# Altium project led-controller2.PrjPcb
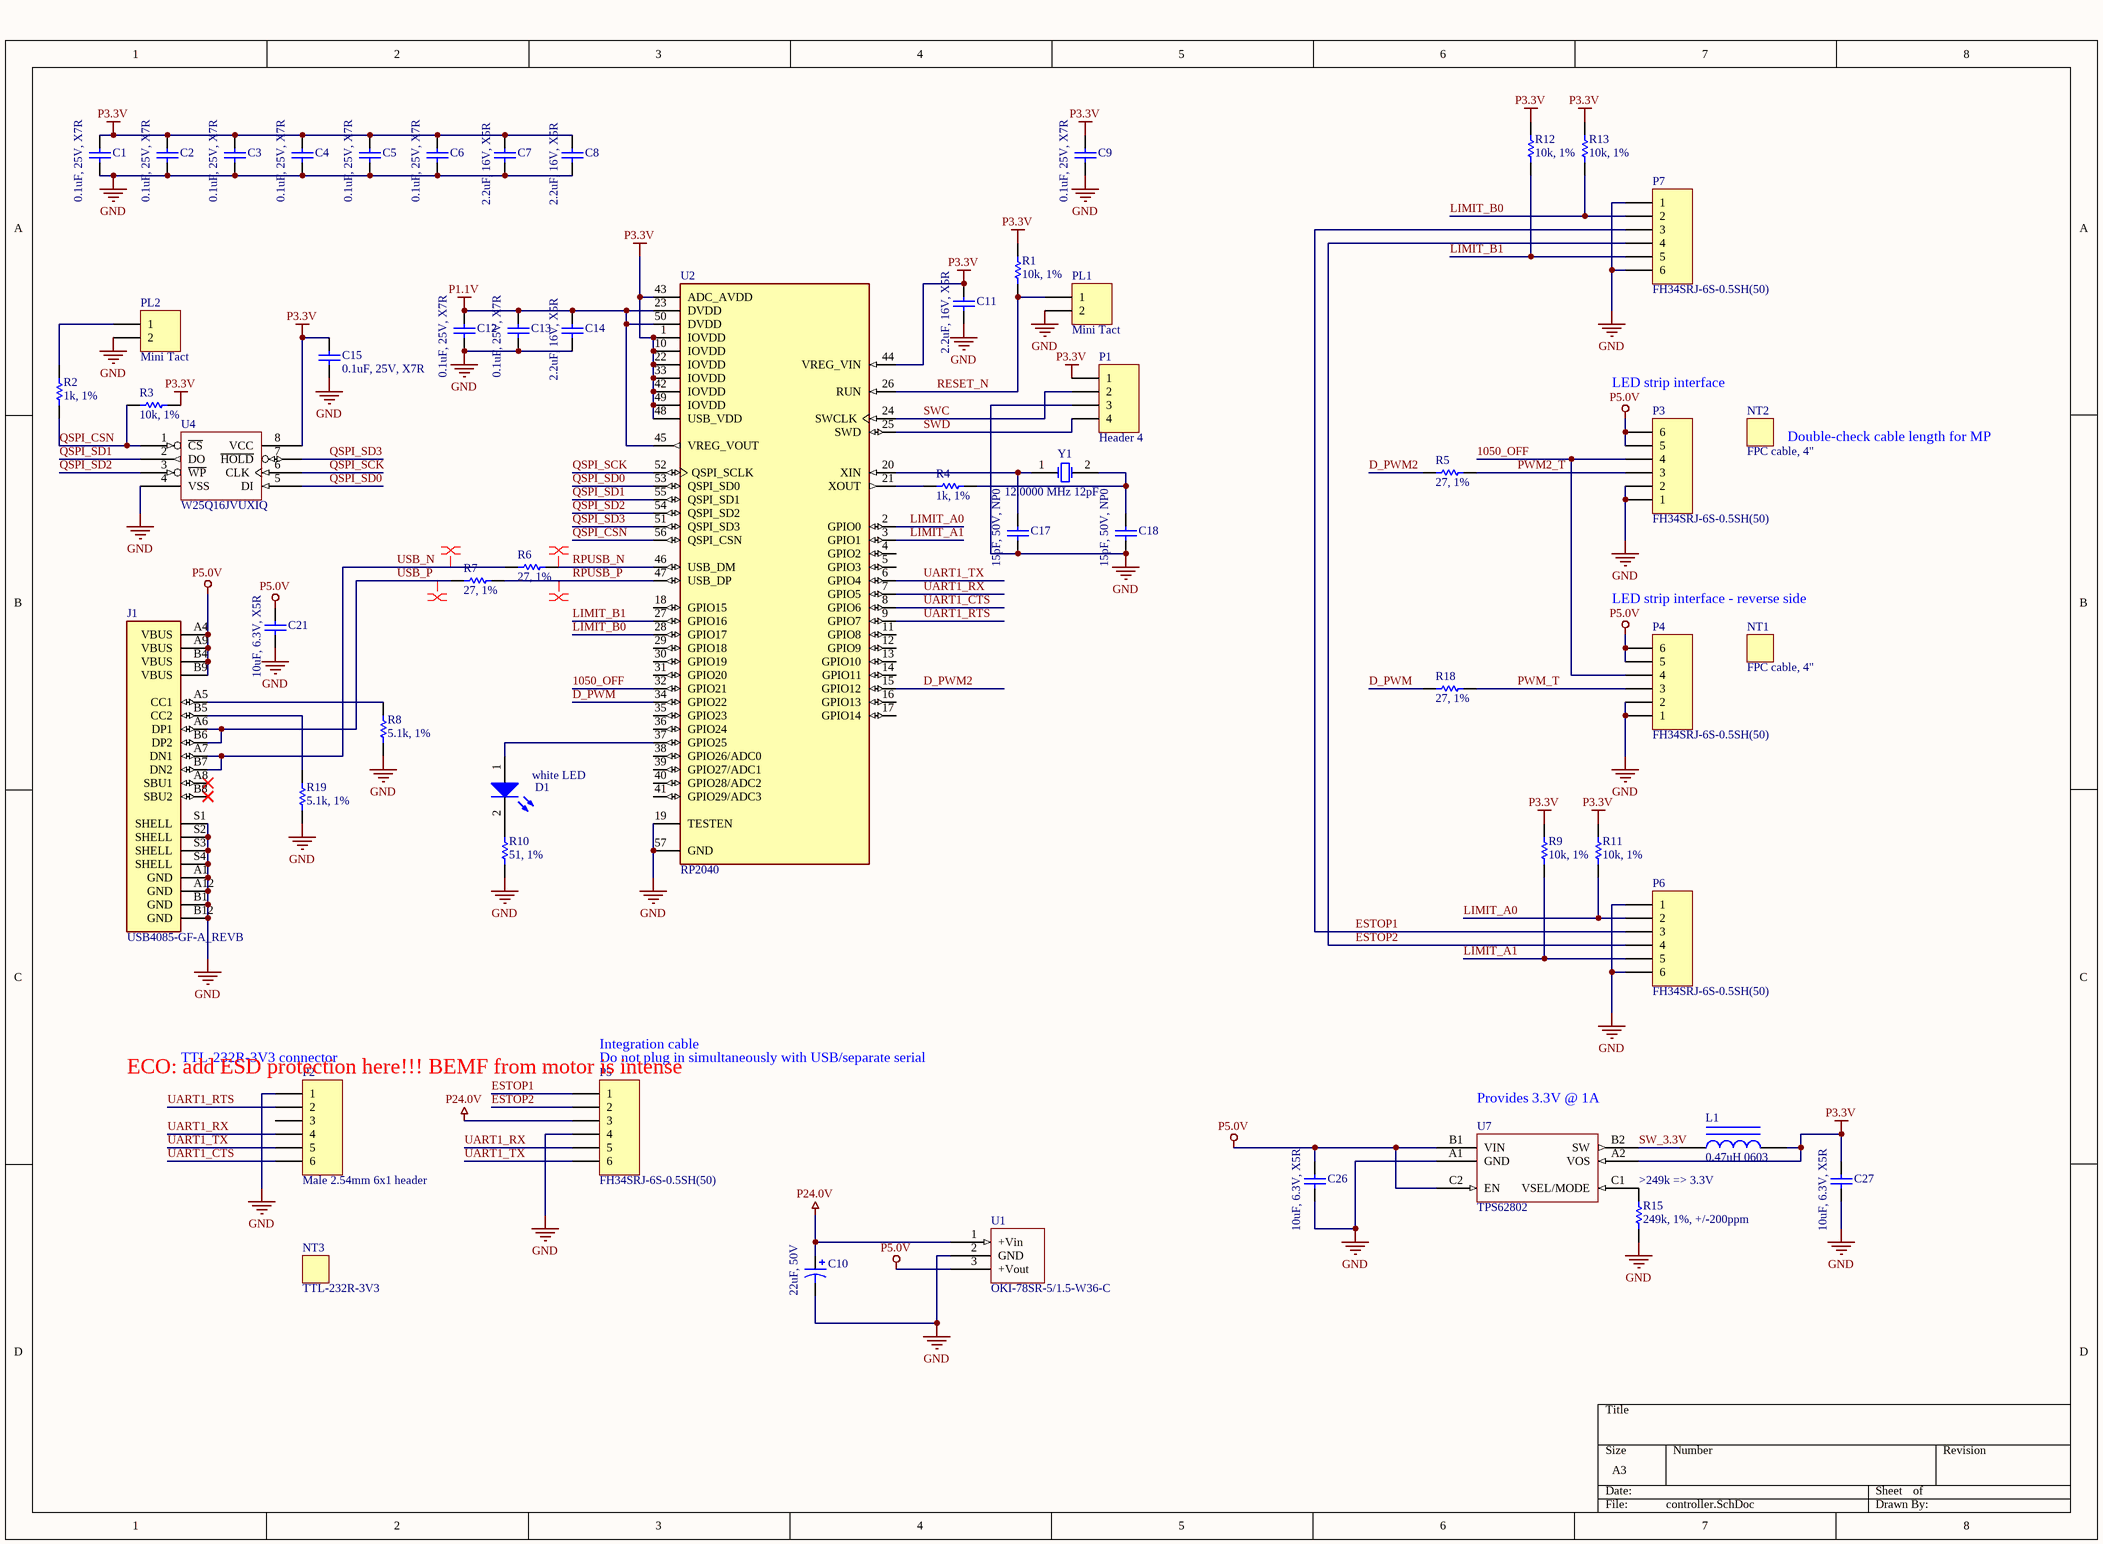
[diagram p0: controller.SchDoc]
1 sheet, 56 parts. Net scope: global (net labels, ports and power ports of the same name join across sheets).
Board file: led-controller2.PcbDoc

## Sheet controller.SchDoc
size A3; SheetNumber: 1; SheetTotal: 1

### Parts
C1  0.1uF, 25V, X7R  [B_CAP0603]
C2  0.1uF, 25V, X7R  [B_CAP0603]
C3  0.1uF, 25V, X7R  [B_CAP0603]
C4  0.1uF, 25V, X7R  [B_CAP0603]
C5  0.1uF, 25V, X7R  [B_CAP0603]
C6  0.1uF, 25V, X7R  [B_CAP0603]
C7  2.2uF, 16V, X5R  [B_CAP0603]
C8  2.2uF, 16V, X5R  [B_CAP0603]
C9  0.1uF, 25V, X7R  [B_CAP0603]
C10  22uF, 50V  [CAPAE7066X61N]
C11  2.2uF, 16V, X5R  [B_CAP0603]
C12  0.1uF, 25V, X7R  [B_CAP0603]
C13  0.1uF, 25V, X7R  [B_CAP0603]
C14  2.2uF, 16V, X5R  [B_CAP0603]
C15  0.1uF, 25V, X7R  [B_CAP0603]
C17  15pF, 50V, NP0  [B_CAP0603]
C18  15pF, 50V, NP0  [B_CAP0603]
C21  10uF, 6.3V, X5R  [B_CAP0603]
C26  10uF, 6.3V, X5R  [B_CAP0603]
C27  10uF, 6.3V, X5R  [B_CAP0603]
D1  white LED  [B_LED0805]
J1  USB4085-GF-A_REVB  [GCT_USB4085-GF-A_REVB]
L1  0.47uH 0603  [B_IND0603]
NT1  FPC cable, 4"
NT2  FPC cable, 4"
NT3  TTL-232R-3V3
P1  Header 4  [HDR1X4]
P2  Male 2.54mm 6x1 header  [HDR1X6]
P3  FH34SRJ-6S-0.5SH(50)  [HRS_FH34SRJ-6S-0.5SH(50)]
P4  FH34SRJ-6S-0.5SH(50)  [HRS_FH34SRJ-6S-0.5SH(50)]
P5  FH34SRJ-6S-0.5SH(50)  [HRS_FH34SRJ-6S-0.5SH(50)]
P6  FH34SRJ-6S-0.5SH(50)  [HRS_FH34SRJ-6S-0.5SH(50)]
P7  FH34SRJ-6S-0.5SH(50)  [HRS_FH34SRJ-6S-0.5SH(50)]
PL1  Mini Tact  [OMRON_B3U-1000P]
PL2  Mini Tact  [OMRON_B3U-1000P]
R1  10k, 1%  [B_RES0603]
R2  1k, 1%  [B_RES0603]
R3  10k, 1%  [B_RES0603]
R4  1k, 1%  [B_RES0603]
R5  27, 1%  [B_RES0603]
R6  27, 1%  [B_RES0603]
R7  27, 1%  [B_RES0603]
R8  5.1k, 1%  [B_RES0603]
R9  10k, 1%  [B_RES0603]
R10  51, 1%  [B_RES0603]
R11  10k, 1%  [B_RES0603]
R12  10k, 1%  [B_RES0603]
R13  10k, 1%  [B_RES0603]
R15  249k, 1%, +/-200ppm  [B_RES0402]
R18  27, 1%  [B_RES0603]
R19  5.1k, 1%  [B_RES0603]
U1  OKI-78SR-5/1.5-W36-C  [MURATA_OKI-78SR]
U2  RP2040  [QFN40P700X700X90-57N]
U4  W25Q16JVUXIQ  [USON-8]
U7  TPS62802  [BGA6C35P2X3_70X105X40_NSMD]
Y1  12.0000 MHz 12pF  [NDK_NX5032A]

### Nets
GND: C1.2 C2.2 C3.2 C4.2 C5.2 C6.2 C7.2 C8.2 C9.2 C10.2 C11.2 C12.2 C13.2 C14.2 C15.1 C17.1 C18.1 C21.2 C26.2 C27.2 J1.A1(GND) J1.A12(GND) J1.B1(GND) J1.B12(GND) J1.S1(SHELL) J1.S2(SHELL) J1.S3(SHELL) J1.S4(SHELL) P1.3 P2.1 P3.1 P3.2 P4.1 P4.2 P5.4 P6.1 P6.6 P7.1 P7.6 PL1.2 PL2.2 R8.1 R10.1 R15.2 R19.1 U1.2(GND) U2.19(TESTEN) U2.57(GND) U4.4(VSS) U7.A1(GND)
P1.1V: C12.1 C13.1 C14.1 U2.23(DVDD) U2.45(VREG_VOUT) U2.50(DVDD)
P3.3V: C1.1 C2.1 C3.1 C4.1 C5.1 C6.1 C7.1 C8.1 C9.1 C11.1 C15.2 C27.1 L1.2 P1.1 R1.1 R3.2 R9.1 R11.1 R12.1 R13.1 U2.1(IOVDD) U2.10(IOVDD) U2.22(IOVDD) U2.33(IOVDD) U2.42(IOVDD) U2.43(ADC_AVDD) U2.44(VREG_VIN) U2.48(USB_VDD) U2.49(IOVDD) U4.8(VCC) U7.A2(VOS)
P5.0V: C21.1 C26.1 J1.A4(VBUS) J1.A9(VBUS) J1.B4(VBUS) J1.B9(VBUS) P3.5 P3.6 P4.5 P4.6 U1.3(+Vout) U7.B1(VIN) U7.C2(EN)
P24.0V: C10.1 P5.3 U1.1(+Vin)
1050_OFF: P3.4 P4.4 U2.32(GPIO21)
D_PWM: R18.1 U2.34(GPIO22)
D_PWM2: R5.1 U2.15(GPIO12)
ESTOP1: P5.1 P6.3 P7.3
ESTOP2: P5.2 P6.4 P7.4
LIMIT_A0: P6.2 R11.2 U2.2(GPIO0)
LIMIT_A1: P6.5 R9.2 U2.3(GPIO1)
LIMIT_B0: P7.2 R13.2 U2.28(GPIO17)
LIMIT_B1: P7.5 R12.2 U2.27(GPIO16)
PWM2_T: P3.3 R5.2
PWM_T: P4.3 R18.2
QSPI_CSN: R2.1 R3.1 U2.56(QSPI_CSN) U4.1(~{CS})
QSPI_SCK: U2.52(QSPI_SCLK) U4.6(CLK)
QSPI_SD0: U2.53(QSPI_SD0) U4.5(DI)
QSPI_SD1: U2.55(QSPI_SD1) U4.2(DO)
QSPI_SD2: U2.54(QSPI_SD2) U4.3(~{WP})
QSPI_SD3: U2.51(QSPI_SD3) U4.7(~{HOLD})
RESET_N: PL1.1 R1.2 U2.26(RUN)
RPUSB_N: R6.2 U2.46(USB_DM)
RPUSB_P: R7.2 U2.47(USB_DP)
SW_3.3V: L1.1 U7.B2(SW)
SWC: P1.2 U2.24(SWCLK)
SWD: P1.4 U2.25(SWD)
UART1_CTS: P2.6 U2.8(GPIO6)
UART1_RTS: P2.2 U2.9(GPIO7)
UART1_RX: P2.4 P5.5 U2.7(GPIO5)
UART1_TX: P2.5 P5.6 U2.6(GPIO4)
USB_N: J1.A7(DN1) J1.B7(DN2) R6.1
USB_P: J1.A6(DP1) J1.B6(DP2) R7.1
NetC17_2: C17.2 U2.20(XIN) Y1.1(OSC1)
NetC18_2: C18.2 R4.2 Y1.2(OSC2)
NetD1_1: D1.1(A) U2.37(GPIO25)
NetD1_2: D1.2(K) R10.2
NetJ1_A5: J1.A5(CC1) R8.2
NetJ1_B5: J1.B5(CC2) R19.2
NetPL2_1: PL2.1 R2.2
NetR4_1: R4.1 U2.21(XOUT)
NetR15_1: R15.1 U7.C1(VSEL/MODE)

Not connected (* = marked no-connect by the designer): J1 A8(SBU1)* B8(SBU2)*; P2 3; U2 4(GPIO2) 5(GPIO3) 11(GPIO8) 12(GPIO9) 13(GPIO10) 14(GPIO11) 16(GPIO13) 17(GPIO14) 18(GPIO15) 29(GPIO18) 30(GPIO19) 31(GPIO20) 35(GPIO23) 36(GPIO24) 38(GPIO26/ADC0) 39(GPIO27/ADC1) 40(GPIO28/ADC2) 41(GPIO29/ADC3)

### Layout directives
differential pair: RPUSB_N, RPUSB_P, USB_N, USB_P

### Notes on the sheet
- LED strip interface
- (near NT2) Double-check cable length for MP
- LED strip interface - reverse side
- ECO: add ESD protection here!!! BEMF from motor is intense
- (near P2) TTL-232R-3V3 connector
- (near P5) Integration cable
- (near P5) Do not plug in simultaneously with USB/separate serial
- (near U7) Provides 3.3V @ 1A
- (near R15) >249k => 3.3V

### Library data of the parts
C1-C6 C9 C12 C13 C15 = Cap Semi: Capacitor (Semiconductor SIM Model); MPN: CC0603KRX7R8BB104; VENDOR: Murata; MYPN: C-104-25-X7R-0603
C7 C8 C11 C14 = Cap Semi: Capacitor (Semiconductor SIM Model); MPN: CL10A225KO8NNNC; VENDOR: Samsung; MYPN: C-225-16-X5R-0603
C10 = Cap Pol1: Polarized Capacitor (Radial); MPN: EEH-ZA1H220P; VENDOR: Panasonic; MYPN: C-226-50-UCL-6.3x8.0
C17 C18 = Cap Semi: Capacitor (Semiconductor SIM Model); MPN: CL10C150JB81PNC; VENDOR: Samsung; MYPN: C-150-50-NP0-0603
C21 C26 C27 = Cap Semi: Capacitor (Semiconductor SIM Model); MPN: CL10A106MQ8NNNC; VENDOR: Samsung; MYPN: C-106-6.3-X5R-0603
D1 = LED2: Typical RED, GREEN, YELLOW, AMBER GaAs LED; MPN: EAST2012WA1; VENDOR: Everlight; MYPN: D-LED-WHITE1-0805
J1 = USB4085-GF-A_REVB: USB-C (USB TYPE-C) USB 2.0 Receptacle Connector 24 (16+8 Dummy) Position Through Hole, Right Angle, low cost, 3.46mm profile, 16 pin, horizontal, Top mount; MF: Global Connector Technology; VENDOR: GCT; Package: None; Price: None; Value: *; SnapEDA_Link: https://www.snapeda.com/parts/USB4085-GF-A/Global+Connector+Technology/view-part/?ref=snap; MP: USB4085-GF-A; Availability: In Stock; Check_prices: https://www.snapeda.com/parts/USB4085-GF-A/Global+Connector+Technology/view-part/?ref=eda; MPN: USB4085-GF-A
L1 = Inductor Iron: Magnetic-Core Inductor; MPN: TFM160808ALC-R47MTAA; VENDOR: TDK; MYPN: L-TFM160808ALC-R47MTAA
NT1 NT2 = NOTE: Placeholder for non-board BOM items; MPN: AFFC-050-06-102-11; VENDOR: assmann WSW Components
NT3 = NOTE: Placeholder for non-board BOM items; MYPN: NT-USB-SERIAL-3.3V; VENDOR: FTDI; MPN: TTL-232R-3V3
P1 = Header 4: Header, 4-Pin; MPN: PH1-04-UA / ANY; VENDOR: Adam Tech / ANY; LatestRevisionDate: 17-Jul-2002; LatestRevisionNote: Re-released for DXP Platform.; Publisher: Altium Limited
P2 = Header 6: Header, 6-Pin; MPN: PH1-06-UA / ANY; VENDOR: Adam Tech / ANY; LatestRevisionDate: 17-Jul-2002; LatestRevisionNote: Re-released for DXP Platform.; Publisher: Altium Limited
P3-P7 = Header 6: Header, 6-Pin; MYPN: J-FH34SRJ-6S-0.5SH(50); VENDOR: HRS; LatestRevisionDate: 17-Jul-2002; LatestRevisionNote: Re-released for DXP Platform.; Publisher: Altium Limited; MPN: FH34SRJ-6S-0.5SH(50)
PL1 PL2 = Header 2: Header, 2-Pin; MPN: B3U-1000P; VENDOR: Omron; MYPN: SW-EVQ-P6DB35; LatestRevisionDate: 17-Jul-2002; LatestRevisionNote: Re-released for DXP Platform.; Publisher: Altium Limited
R1 R3 R9 R11-R13 = Res1: Resistor; MPN: RC0603FR-0710KL; VENDOR: Yageo; MYPN: R-103-1P-1_16W-0603
R2 R4 = Res1: Resistor; VENDOR: ANY; MYPN: R-102-1P-1_16W-0603; MPN: ANY
R5-R7 R18 = Res1: Resistor; VENDOR: ANY; MYPN: R-270-1P-1_16W-0603; MPN: ANY
R8 R19 = Res1: Resistor; MPN: RC0603FR-075K1L; VENDOR: Yageo; MYPN: R-512-1P-1_16W-0603
R10 = Res1: Resistor; VENDOR: ANY; MYPN: R-510-1P-1_16W-0603; MPN: ANY
R15 = Res1: Resistor; MPN: RC0402FR-07249KL; VENDOR: Yageo; MYPN: R-2493-1P-1_16W-0402
U1 = VR20: OKI-78SR switching regulator; MFG: Murata; MPN: OKI-78SR-5/1.5-W36-C
U2 = RP2040: RP2040 chip for Raspberry Pi Pico - ARMÂ® CortexÂ®-M0+ MCU 32-Bit; MPN: SC0914(7/13); Check_prices: https://www.snapeda.com/parts/RP2040/Raspberry+Pi/view-part/?ref=eda; Value: *; Availability: In Stock; MP: RP2040; Price: None; Package: None; SnapEDA_Link: https://www.snapeda.com/parts/RP2040/Raspberry+Pi/view-part/?ref=snap; Purchase-URL: https://pricing.snapeda.com/search/part/RP2040/?ref=eda; MF: Raspberry Pi; VENDOR: Raspberry Pi
U4 = EN25P05-50GCP: 16Mbit SPI NOR FLASH; MYPN: UW25Q16JVUXIQ TR; VENDOR: Winbond; MPN: W25Q16JVUXIQ
U7 = TPS62802: Buck regulator, 4MHz, 0.6A, 1.8V-3.3V, low Iq; MPN: TPS62802YKAR; VENDOR: TI; MYPN: U-TPS62802YKA(T/R)
Y1 = XTAL: Crystal Oscillator; MPN: ECS-120-12-30-JGN-TR; VENDOR: ECS; Published: 8-Jun-2000; LatestRevisionDate: 17-Jul-2002; LatestRevisionNote: Re-released for DXP Platform.; PackageReference: R38; Publisher: Altium Limited